# EAGLE design peripheral (EAGLE 6.4)
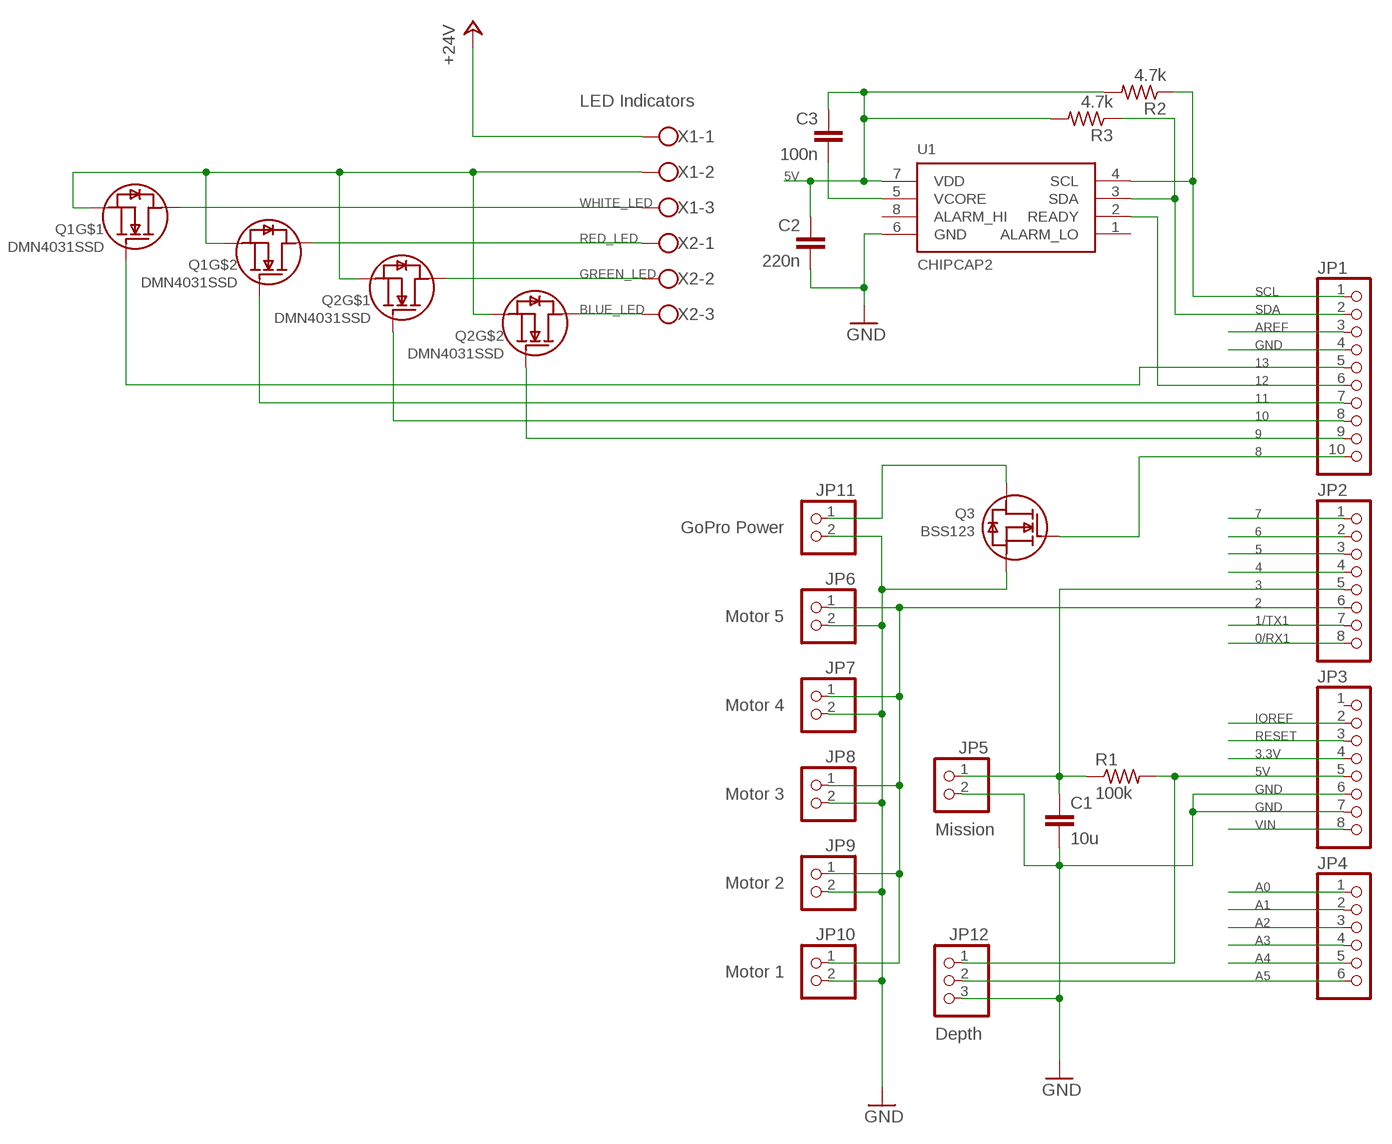
[diagram p0: schematic, sheet 1]

## Parts
C1  10u  C-EUC0805K  [C0805K]
C2  220n  C-EUC0603  [C0603]
C3  100n  C-EUC0603  [C0603]
JP1  PINHD-1X10  [1X10]
JP2  PINHD-1X8  [1X08]
JP3  PINHD-1X8  [1X08]
JP4  PINHD-1X6  [1X06]
JP5  PINHD-1X2  [1X02]
JP6  PINHD-1X2  [1X02]
JP7  PINHD-1X2  [1X02]
JP8  PINHD-1X2  [1X02]
JP9  PINHD-1X2  [1X02]
JP10  PINHD-1X2  [1X02]
JP11  PINHD-1X2  [1X02]
JP12  PINHD-1X3  [1X03]
Q1  DMN4031SSD  [SO-8]
Q2  DMN4031SSD  [SO-8]
Q3  BSS123  [SOT-23]
R1  100k  R-US_R0805  [R0805]
R2  4.7k  R-US_R0603  [R0603]
R3  4.7k  R-US_R0603  [R0603]
U1  CHIPCAP2  [CHIPCAP2]
X1  W237-103  [W237-103]
X2  W237-103  [W237-103]

## Nets
0/RX1: JP2.8
1/TX1: JP2.7
2: JP2.6 JP6.1 JP7.1 JP8.1 JP9.1 JP10.1
3: C1.1 JP2.5 JP5.1 R1.1
3.3V: JP3.4
4: JP2.4
5: JP2.3
5V: C2.1 C3.1 JP3.5 JP12.1 R1.2 R2.2 R3.2 U1.7(VDD)
6: JP2.2
7: JP2.1
8: JP1.10 Q3.1(G)
9: JP1.9 Q2.2(G)
10: JP1.8 Q2.4(G)
11: JP1.7 Q1.2(G)
12: JP1.6 U1.2(READY)
13: JP1.5 Q1.4(G)
+24V: X1.1
A0: JP4.1
A1: JP4.2
A2: JP4.3
A3: JP4.4
A4: JP4.5
A5: JP4.6 JP12.2
AREF: JP1.3
BLUE_LED: Q2.7(D) Q2.8(D) X2.3
GND: C1.2 C2.2 JP1.4 JP3.6 JP3.7 JP5.2 JP6.2 JP7.2 JP8.2 JP9.2 JP10.2 JP11.2 JP12.3 Q3.3(S) U1.6(GND)
GREEN_LED: Q2.5(D) Q2.6(D) X2.2
IOREF: JP3.2
N$2: JP11.1 Q3.2(D)
N$3: C3.2 U1.5(VCORE)
N$6: Q1.1(S) Q1.3(S) Q2.1(S) Q2.3(S) X1.2
RED_LED: Q1.7(D) Q1.8(D) X2.1
RESET: JP3.3
SCL: JP1.1 R2.1 U1.4(SCL)
SDA: JP1.2 R3.1 U1.3(SDA)
VIN: JP3.8
WHITE_LED: Q1.5(D) Q1.6(D) X1.3
Unconnected: JP3.1 U1.1(ALARM_LO) U1.8(ALARM_HI)

## Notes on the sheet
- LED Indicators
- GoPro Power
- Motor 5
- Motor 4
- Motor 3
- Mission
- Motor 2
- Motor 1
- Depth

## Library data of the parts
C1-C3 = resistor:C-EU: CAPACITOR, European symbol
JP1 = pinhead:PINHD-1X10: PIN HEADER
JP2 JP3 = pinhead:PINHD-1X8: PIN HEADER
JP4 = pinhead:PINHD-1X6: PIN HEADER
JP5-JP11 = pinhead:PINHD-1X2: PIN HEADER
JP12 = pinhead:PINHD-1X3: PIN HEADER
Q1 Q2 = peripheral:DMN4031SSD
Q3 = peripheral:BSS123
R1-R3 = resistor:R-US_: RESISTOR, American symbol
U1 = peripheral:CHIPCAP2
X1 X2 = con-wago-500:W237-103: WAGO SCREW CLAMP; MPN: 237-103; OC_FARNELL: unknown; OC_NEWARK: 18M7116

## Board
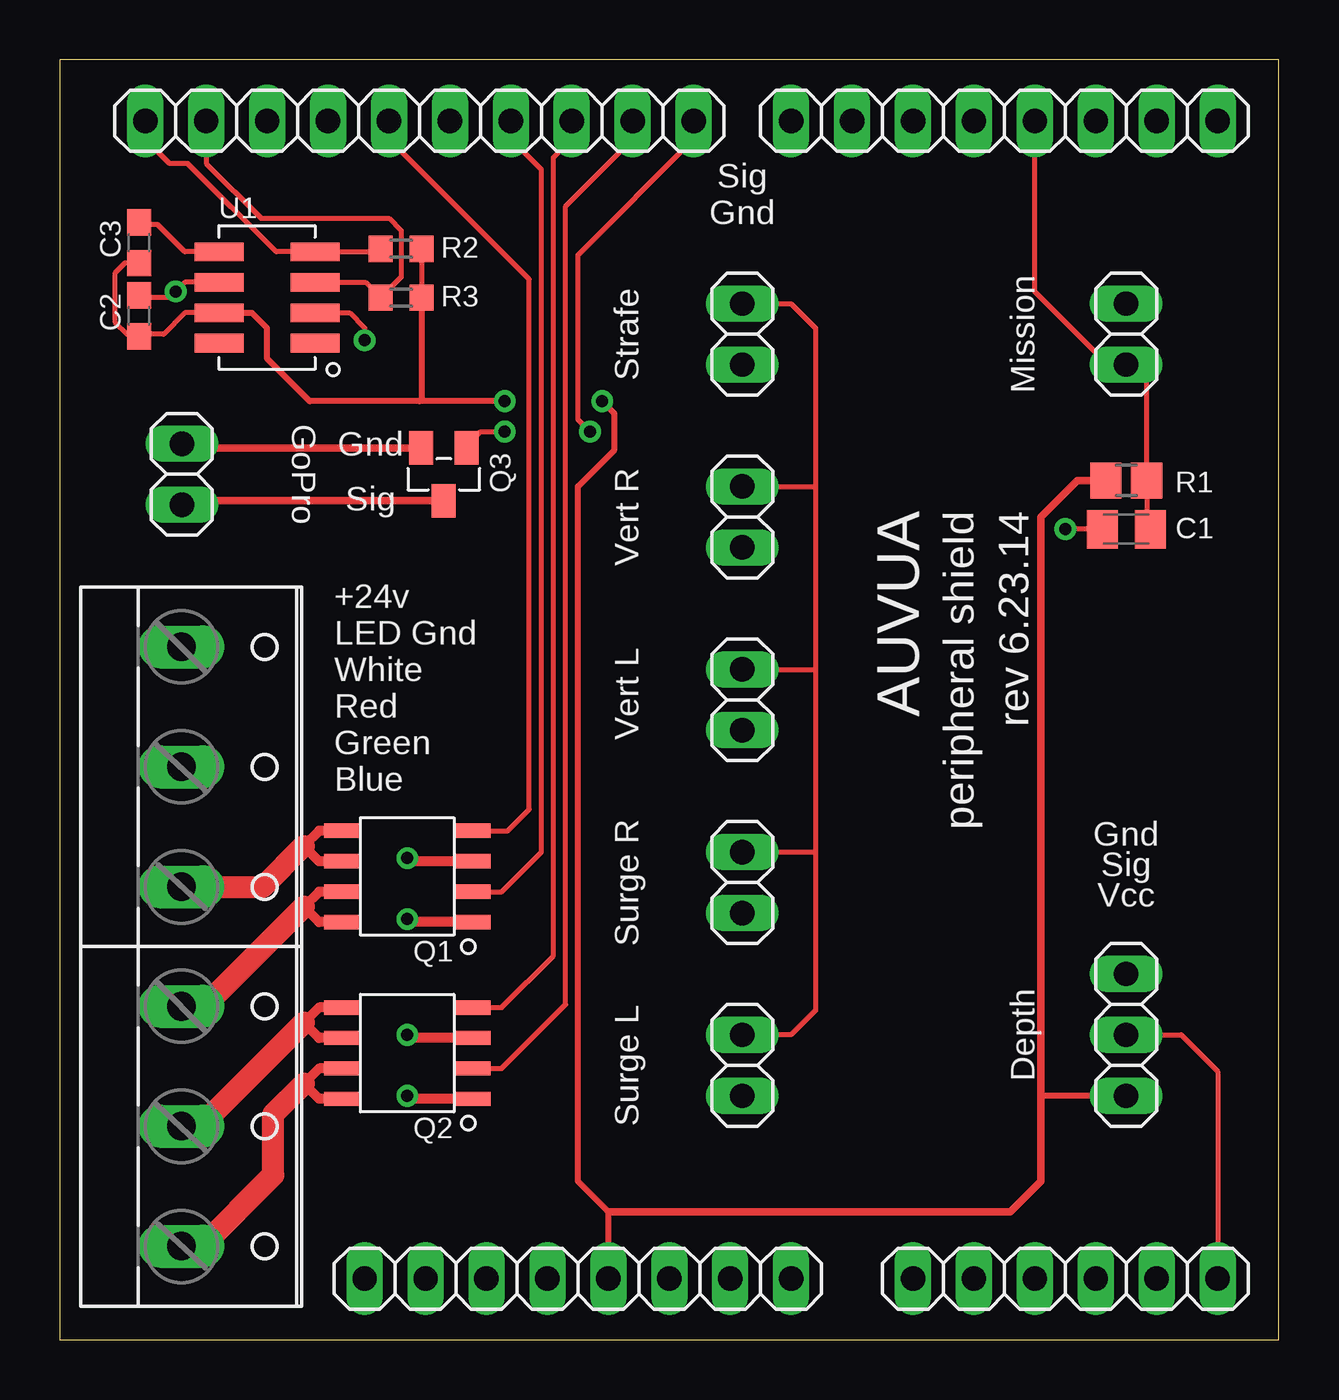
[diagram p1: board, top side]
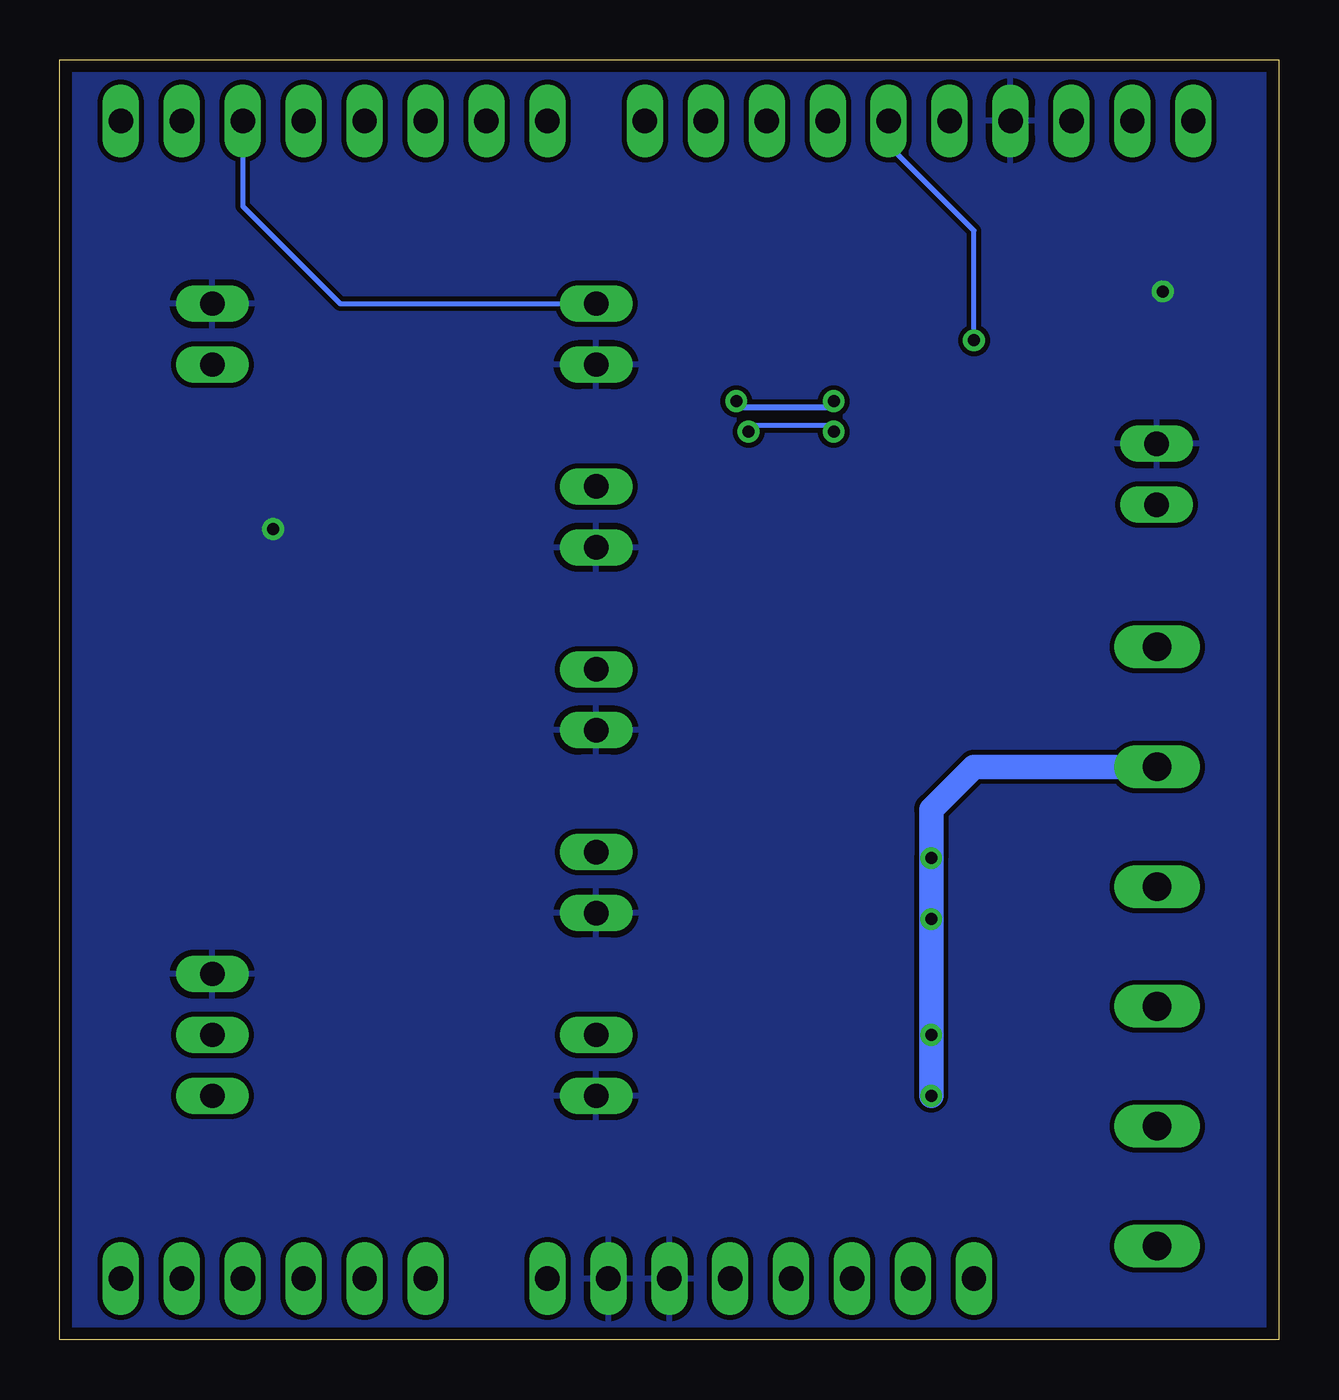
[diagram p2: board, bottom side, seen from below]

Size 50.8 x 53.34 mm. Coordinates in mm from the lower left corner, seen from the top.
Outline: 0,0 50.8,0 50.8,53.34 0,53.34 0,0
Copper layers (1*16): Top 0.035mm / dielectric 1.5mm / Bottom 0.035mm
Design rules "default *": minimum track width 10mil, minimum drill 24mil, track to track 8mil, track to pad 8mil, pad to pad 8mil, via to via 8mil, smd to smd 8mil, copper to edge 20mil, drill to drill 8mil, minimum pad ring 10mil, minimum via ring 8mil, stop-mask expansion 4mil, vias tented up to drill 0mil, thermal gap 10mil

### Footprints (pad centres in the part's own frame; a part is rotated, then mirrored left to right if it is on the bottom)
C0805K = smd 1.3 x 1.6: 1 -1,0; 2 1,0
C0603 = smd 1.1 x 1: 1 -0.85,0; 2 0.85,0
1X10 = drill 1.016 long: 1 -11.43,0; 2 -8.89,0; 3 -6.35,0; 4 -3.81,0; 5 -1.27,0; 6 1.27,0; 7 3.81,0; 8 6.35,0; 9 8.89,0; 10 11.43,0
1X08 = drill 1.016 long: 1 -8.89,0; 2 -6.35,0; 3 -3.81,0; 4 -1.27,0; 5 1.27,0; 6 3.81,0; 7 6.35,0; 8 8.89,0
1X06 = drill 1.016 long: 1 -6.35,0; 2 -3.81,0; 3 -1.27,0; 4 1.27,0; 5 3.81,0; 6 6.35,0
1X02 = drill 1.016 long: 1 -1.27,0; 2 1.27,0
1X03 = drill 1.016 long: 1 -2.54,0; 2 0,0; 3 2.54,0
SO-8 = smd 0.6 x 1.55: 1 -1.905,-2.7; 2 -0.635,-2.7; 3 0.635,-2.7; 4 1.905,-2.7; 5 1.905,2.7; 6 0.635,2.7; 7 -0.635,2.7; 8 -1.905,2.7
SOT-23 = smd 1 x 1.4: 1 -0.95,-1.1; 2 0,1.1; 3 0.95,-1.1
R0805 = smd 1.3 x 1.5: 1 -0.85,0; 2 0.85,0
R0603 = smd 1 x 1.1: 1 -0.85,0; 2 0.85,0
CHIPCAP2 = smd 2.032 x 0.787: 1 2,-1.905; 2 2,-0.635; 3 2,0.635; 4 2,1.905; 5 -2,1.905; 6 -2,0.635; 7 -2,-0.635; 8 -2,-1.905
W237-103 = drill 1.194 long: 1 -5,-1.29; 2 0,-1.29; 3 5,-1.29

### Placement (x,y rotation side)
C1  44.45,33.78 180 top
C2  3.3,42.67 90 top
C3  3.3,45.72 90 top
JP1  14.99,50.8 0 top
JP2  39.37,50.8 0 top
JP3  21.59,2.54 0 top
JP4  41.91,2.54 0 top
JP5  44.45,41.91 90 top
JP6  28.45,41.91 270 top
JP7  28.45,34.29 270 top
JP8  28.45,26.67 270 top
JP9  28.45,19.05 270 top
JP10  28.45,11.43 270 top
JP11  5.08,36.07 90 top
JP12  44.45,12.7 90 top
Q1  14.48,19.3 90 top
Q2  14.48,11.94 90 top
Q3  16,36.07 180 top
R1  44.45,35.81 180 top
R2  14.22,45.47 0 top
R3  14.22,43.43 0 top
U1  8.64,43.43 0 top
X1  6.35,23.88 270 top
X2  6.35,8.89 270 top

### Tracks (layer width: path | path; a pad name or v marks a point on that pad's centre or on a via)
2
  Top 0.203: JP6.1 30.48,43.18 31.5,42.16 31.5,35.56 | 31.5,35.56 31.5,27.94 | 31.5,27.94 31.5,20.32 | 31.5,20.32 31.5,13.72 30.48,12.7 JP10.1 | JP9.1 31.5,20.32 | JP8.1 31.5,27.94 | JP7.1 31.5,35.56
  Bottom 0.203: JP2.6 43.18,47.24 39.12,43.18 JP6.1
3
  Top 0.203: JP2.5 40.64,43.69 43.69,40.64 JP5.1 44.96,40.64 45.3,40.3 R1.1 45.3,33.93 C1.1
5V  (via drill 0.5)
  Top 0.203: 43.43,10.16 JP12.1 | U1.7 5.21,42.8 4.32,41.91 3.39,41.91 C2.1 3.21,41.91 2.79,41.91 2.29,42.42 2.29,44.45 2.71,44.87 C3.1 | R2.2 R3.2
  Top 0.254: 43.43,10.16 40.89,10.16 | JP3.5 22.86,5.33 21.59,6.6 21.59,35.56 23.11,37.08 23.11,38.61 v22.61,39.12 | v18.54,39.12 14.99,39.12 | 14.99,39.12 10.41,39.12 8.64,40.89 8.64,42.16 8,42.8 U1.7 | R3.2 15.07,39.2 14.99,39.12
  Top 0.305: R1.2 42.42,35.81 40.89,34.29 40.89,10.16 40.89,6.6 39.62,5.33 22.86,5.33
  Bottom 0.254: v22.61,39.12 22.35,38.86 18.8,38.86 v18.54,39.12
8  (via drill 0.5)
  Top 0.203: Q3.1 17.53,37.85 v18.54,37.85 | v22.1,37.85 21.59,38.35 21.59,45.21 26.42,50.04 JP1.10
  Bottom 0.203: v18.54,37.85 18.8,38.1 21.84,38.1 v22.1,37.85
9
  Top 0.203: Q2.2 18.41,11.3 21.08,13.97 21.08,47.24 23.88,50.04 JP1.9
10
  Top 0.203: Q2.4 18.41,13.84 20.57,16 20.57,49.28 21.34,50.04 JP1.8
11
  Top 0.203: Q1.2 18.41,18.67 20.07,20.32 20.07,48.77 18.8,50.04 JP1.7
12  (via drill 0.5)
  Top 0.203: U1.2 12.06,42.8 12.7,42.16 v12.7,41.66
  Bottom 0.203: v12.7,41.66 12.7,46.23 16.26,49.78 JP1.6
13
  Top 0.203: Q1.4 18.67,21.21 19.56,22.1 19.56,44.2 13.72,50.04 JP1.5
A5
  Top 0.203: JP12.2 46.74,12.7 48.26,11.18 JP4.6
BLUE_LED
  Top 0.406: Q2.7 10.79,11.3 10.16,10.67 10.79,10.03 Q2.8
  Top 0.914: X2.3 5.92,3.89 8.89,6.86 8.89,9.4 10.16,10.67
GND  (via drill 0.5)
  Top 0.203: C1.2 v41.91,33.78 | U1.6 5.21,44.07 v4.83,43.69 4.57,43.43 3.39,43.43 C2.2
  Top 0.305: Q3.3 5.25,37.17 JP11.2
  pour Bottom: -0.51,53.85 51.56,53.85 51.56,-0.76 -0.51,-0.76
GREEN_LED
  Top 0.406: Q2.5 10.79,13.84 10.16,13.21 10.79,12.57 Q2.6
  Top 0.914: X2.2 5.84,8.89 10.16,13.21
N$2
  Top 0.305: Q3.2 5.25,34.97 JP11.1
N$3
  Top 0.203: U1.5 5.21,45.34 4.06,46.48 3.39,46.48 C3.2
N$6  (via drill 0.5)
  Top 0.406: Q1.3 14.61,19.94 v14.48,20.07 | Q1.1 14.61,17.4 v14.48,17.53 | Q2.1 14.61,10.03 v14.48,10.16 | Q2.3 14.61,12.57 v14.48,12.7
  Bottom 1.016: X1.2 12.7,23.88 14.48,22.1 v14.48,20.07 v14.48,17.53 v14.48,12.7 v14.48,10.16
RED_LED
  Top 0.406: Q1.7 10.79,18.67 10.16,18.03 10.79,17.4 Q1.8
  Top 0.914: X2.1 6.02,13.89 10.16,18.03
SCL
  Top 0.203: R2.1 13.25,45.34 U1.4 9.02,45.34 5.33,49.02 4.57,49.02 3.56,50.04 JP1.1
SDA
  Top 0.203: U1.3 12.74,44.07 R3.1 14.22,44.28 14.22,46.23 13.72,46.74 8.38,46.74 6.1,49.02 JP1.2
WHITE_LED
  Top 0.406: Q1.6 10.79,19.94 10.16,20.57 10.79,21.21 Q1.5
  Top 0.914: X1.3 8.46,18.88 10.16,20.57

### Text on the board
tPlace: Sig | Gnd | Strafe | Mission | Gnd | GoPro | Sig | AUVUA | peripheral shield | rev 6.23.14 | Vert R | +24v | LED Gnd | White | Vert L | Red | Green | Blue | Gnd | Sig | Surge R | Vcc | Depth | Surge L